# Altium schematic sheet Real Time Clock.SchDoc: Real Time Clock
size OrCAD A; DocumentNumber: LM-003; Revision: 3.0; SheetNumber: 8; SheetTotal: 11
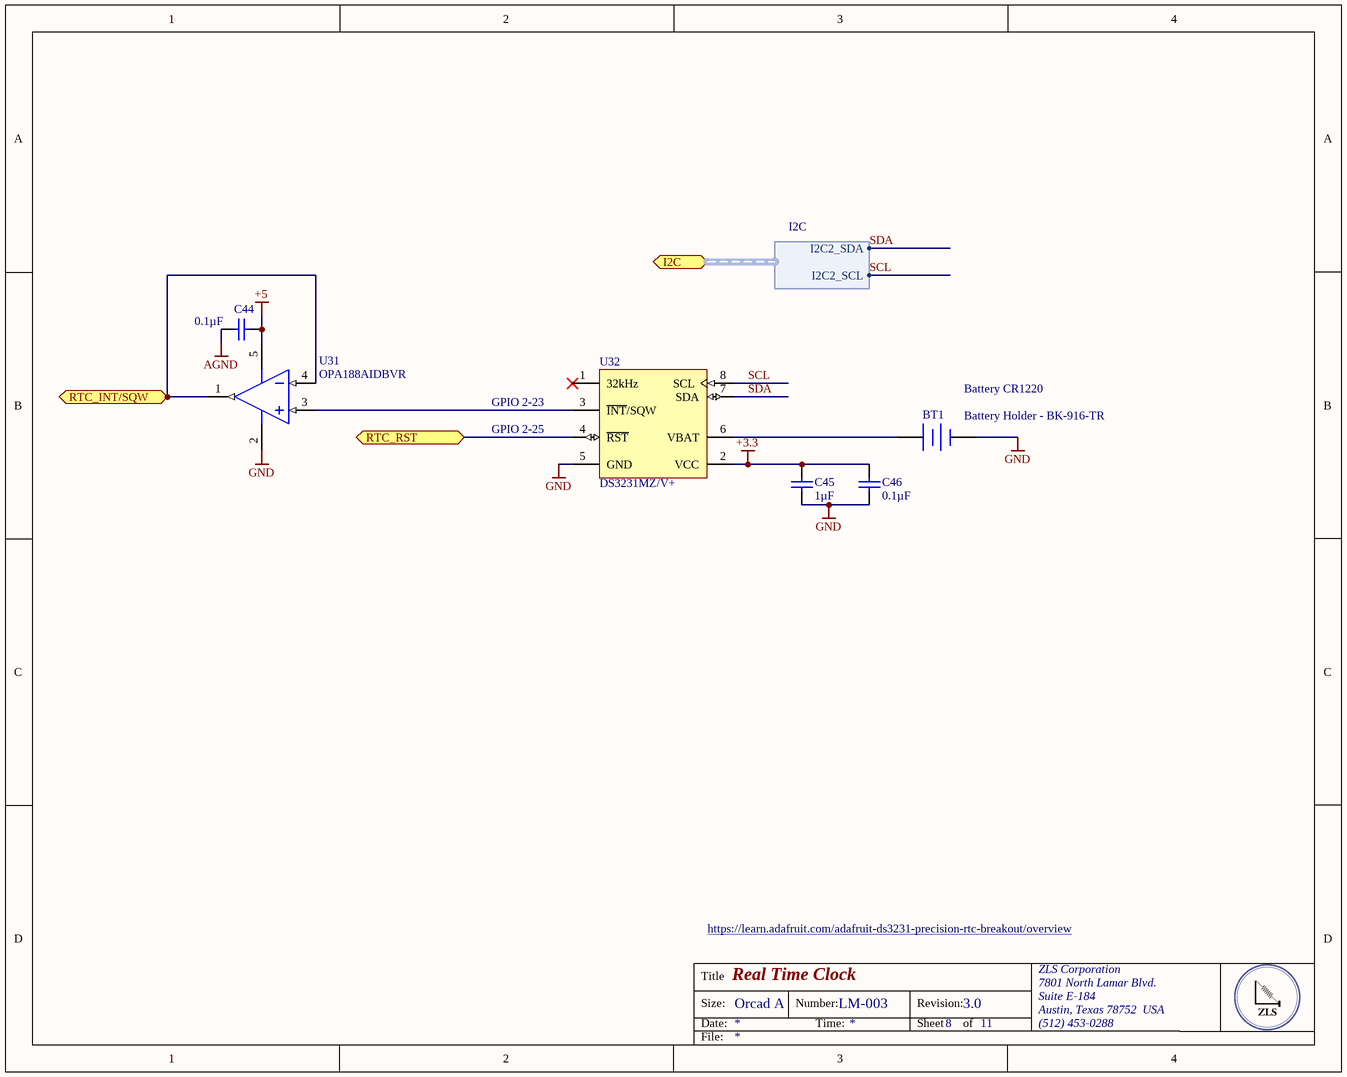
[diagram p0: Real Time Clock.SchDoc]

## Parts
BT1  Battery Holder - BK-916-TR  [BK-916-TR]
C44  Capacitance: 0.1µF  [CAPC0805(2012)145_N]  (hidden comment: CAP CER 0.1UF 16V X7R 0805)
C45  Capacitance: 1µF  [CAPC0805(2012)100_M]  (hidden comment: CAP 1uF 25V 0805(2012))
C46  Capacitance: 0.1µF  [CAPC0805(2012)100_N]  (hidden comment: CAP 100nF 25V 0805(2012))
U31  OPA188AIDBVR  [DBV0005A_M]
U32  DS3231MZ/V+  [S8MK+1_N]

## Ports
I2C (harness I2C), RTC_INT/SQW, RTC_RST (bidir)

## Harnesses
I2C: I2C2_SDA, I2C2_SCL

## Nets
+3.3: C45.1 C46.1 U32.2(VCC)
+5: C44.2 U31.5(V+)
AGND: C44.1
GND: BT1.2(-) C45.2 C46.2 U31.2(V-) U32.5(GND)
RTC_INT/SQW: U31.1(OUT) U31.4(IN-) ; port RTC_INT/SQW
RTC_RST: U32.4(~{RST}) ; port RTC_RST
SCL: U32.8(SCL) ; port I2C.I2C2_SCL
SDA: U32.7(SDA) ; port I2C.I2C2_SDA
NetBT1_1: BT1.1(+) U32.6(VBAT)
NetU31_3: U31.3(IN+) U32.3(~{INT}/SQW)

Not connected (* = marked no-connect by the designer): U32 1(32kHz)*

## Notes on the sheet
- (near U32) GPIO 2-23
- (near BT1) Battery CR1220
- (near U32) GPIO 2-25
- https://learn.adafruit.com/adafruit-ds3231-precision-rtc-breakout/overview
- Title
- Size:
- Date:
- Orcad A
- Number:
- Time:
- Revision:
- Sheet
- of
- ZLS Corporation
- 7801 North Lamar Blvd.
- Suite E-184
- Austin, Texas 78752  USA
- (512) 453-0288
- File:

## Library data of the parts
BT1 = Battery: CR1220, 1225 BATTERY RETAINER W/; Manufacturer 1: MPD (Memory Protection Devices); Category 1: Battery Products; Battery Type, Function: Coin Cell, Retainer; Battery Cell Size: Coin, 12.0mm; Number of Cells: 1; Battery Series: 1216, 1220, 1225; Supplier 1: Digi-Key; Supplier Part Number 1: BK-916-CT-ND; Manufacturer Part Number 1: BK-916-TR; RoHS 1: RoHS Compliant; Description 1: CR1220, 1225 BATTERY RETAINER W/; Stock 1: 7084; Pricing 1: 1=0.49, 10=0.449, 100=0.408, 500=0.357 (USD); Part Status: Active; Style: Retainer; Mounting Type: PCB, Surface Mount; Termination Style: SMD (SMT) Tab; Height Above Board: 0.551" (14.00mm); Operating Temperature: -; ComponentLink1URL: http://www.memoryprotectiondevices.com/datasheets/BK-916-datasheet.pdf; ComponentLink1Description: http://www.memoryprotectiondevices.com/datasheets/BK-916-datasheet.pdf
C44 = CMP-1036-04795-1: Manufacturer: Murata Electronics North America; Manufacturer Part Number: GRM219R71C104KA01D; Tolerance: ±10%; Voltage - Rated: 25V; Supplier Part Number 1: 490-1673-6-ND; Temperature Coefficient: X7R; Thickness (Max): 0.053" (1.35mm); Supplier 2: Digi-Key; Supplier Part Number 2: 490-1683-6-ND; RoHS: RoHS Compliant; Category: Capacitors; Stock 2: 245331; Pricing 2: 1=0.14, 10=0.098, 100=0.0462, 500=0.0324, 1000=0.02683 (USD); Packaging: Digi-Reel®; Part Status: Active; Operating Temperature: -55°C ~ 125°C; Features: -; Ratings: -; Applications: General Purpose; Mounting Type: Surface Mount, MLCC; Package / Case: 0805 (2012 Metric); Size / Dimension: 0.079" L x 0.049" W (2.00mm x 1.25mm); Height - Seated (Max): -; Lead Spacing: -; Lead Style: -; ComponentLink1URL: http://www.murata.com/~/media/webrenewal/support/library/catalog/products/capacitor/mlcc/c02e.ashx; ComponentLink1Description: http://www.murata.com/~/media/webrenewal/support/library/catalog/products/capacitor/mlcc/c02e.ashx
C45 = CMP-1036-04754-1: CAP 1uF 25V ±10% 0805 (2012 Metric) Thickness 1mm SMD; Manufacturer: Murata Electronics North America; Manufacturer Part Number: GRM21BR71E105KA99L; Temperature Coefficient: X7R; Supplier 1: Digi-Key; Supplier Part Number 1: 490-6484-1-ND; RoHS: RoHS Compliant; Category: Capacitors; Stock 1: 295334; Pricing 1: 1=0.14, 10=0.099, 100=0.0468, 1000=0.02715 (USD); Packaging: Cut Tape (CT); Part Status: Active; Tolerance: ±10%; Voltage - Rated: 25V; Operating Temperature: -55°C ~ 125°C; Features: -; Ratings: -; Applications: General Purpose; Mounting Type: Surface Mount, MLCC; Package / Case: 0805 (2012 Metric); Size / Dimension: 0.079" L x 0.049" W (2.00mm x 1.25mm); Height - Seated (Max): -; Thickness (Max): 0.053" (1.35mm); Lead Spacing: -; Lead Style: -; ComponentLink1URL: http://www.murata.com/~/media/webrenewal/support/library/catalog/products/capacitor/mlcc/c02e.ashx; ComponentLink1Description: http://www.murata.com/~/media/webrenewal/support/library/catalog/products/capacitor/mlcc/c02e.ashx
C46 = CMP-1036-04416-1: CAP 100nF 25V -20% to +80% 0805 (2012 Metric) Thickness 1mm SMD; Manufacturer: Murata Electronics North America; Manufacturer Part Number: GRM21BR71E104KA01L; Tolerance: ±10%; Temperature Coefficient: X7R; Supplier 1: Digi-Key; Supplier Part Number 1: 490-1673-1-ND; RoHS: RoHS Compliant; Category: Capacitors; Stock 1: 895391; Pricing 1: 1=0.2, 10=0.145, 100=0.0683, 500=0.04788, 1000=0.03964 (USD); Packaging: Cut Tape (CT); Part Status: Active; Voltage - Rated: 25V; Operating Temperature: -55°C ~ 125°C; Features: -; Ratings: -; Applications: General Purpose; Mounting Type: Surface Mount, MLCC; Package / Case: 0805 (2012 Metric); Size / Dimension: 0.079" L x 0.049" W (2.00mm x 1.25mm); Height - Seated (Max): -; Thickness (Max): 0.053" (1.35mm); Lead Spacing: -; Lead Style: -; ComponentLink1URL: http://www.murata.com/~/media/webrenewal/support/library/catalog/products/capacitor/mlcc/c02e.ashx; ComponentLink1Description: http://www.murata.com/~/media/webrenewal/support/library/catalog/products/capacitor/mlcc/c02e.ashx
U31 = CMP-0809-00005-2: Precision, Low Noise, Rail-to-Rail Output, Zero-Drift Operational Amplifier, 4 to 36 V, -40 to 125 degC, 5-pin SOT23 (DBV5), Green (RoHS & no Sb/Br); Manufacturer: Texas Instruments; Total Supply Voltage(Min)(+5V is 5, +/-5V is 10): 4; Offset Drift(Typ)(uV/C): 0.03; Rating: Catalog; SubFamily: Zero Drift Precision Amplifier; GBW(Typ)(MHz): 2; Slew Rate(Typ)(V/us): 0.8; Number of Channels: 1; CMRR(Min)(dB): 120; Iq per channel(Max)(mA): 0.51; Total Supply Voltage(Max)(+5V is 5, +/-5V is 10): 36; PartNumber: OPA188AIDBVR; ComponentLink2Description: Datasheet; ComponentLink2URL: http://www.ti.com/lit/ds/symlink/opa188.pdf; ComponentLink1Description: Manufacturer URL; Mounting Technology: Surface Mount; Eco-Plan: Green (RoHS & no Sb/Br); ComponentLink1URL: http://www.ti.com/; PackageVersion: 4073253-4/K, 03/2006; DatasheetVersion: SBOS642A; ComponentLink3Description: Package Specification; PackageReference: DBV0005A; ComponentLink3URL: http://www.ti.com/litv/pdf/mpds018i; PackageDescription: 5-Pin Plastic Small Outline, Body 1.6 x 2.9 mm, Pitch 0.95 mm; Code_JEDEC: MO-178
U32 = CMP-0254-00374-1: +/-5ppm, I2C Real-Time Clock with Internal MEMs Resonator, 8-Pin SO, -40 to 85 degC, Automotive Qualified, Pb-Free; PackageDescription: 8-Pin Small-Outline IC, Narrow (0.15in), 1.27 mm Pitch, SOIC (N), Pb-Free; PackageVersion: revC, 2010; PackageReference: S8MK+1; ComponentLink1URL: http://www.maxim-ic.com; ComponentLink3Description: Package Specification; DatasheetVersion: Rev 3, Dec-2011; ComponentLink3URL: http://pdfserv.maxim-ic.com/package_dwgs/21-0041.PDF; ComponentLink1Description: Manufacturer URL; Code_JEDEC: MS-012-AA; ComponentLink2Description: Datasheet; Code_IPC: SOIC127P600-8; ComponentLink2URL: http://datasheets.maxim-ic.com/en/ds/DS3231M.pdf